# EAGLE design picduino (EAGLE 5.06)
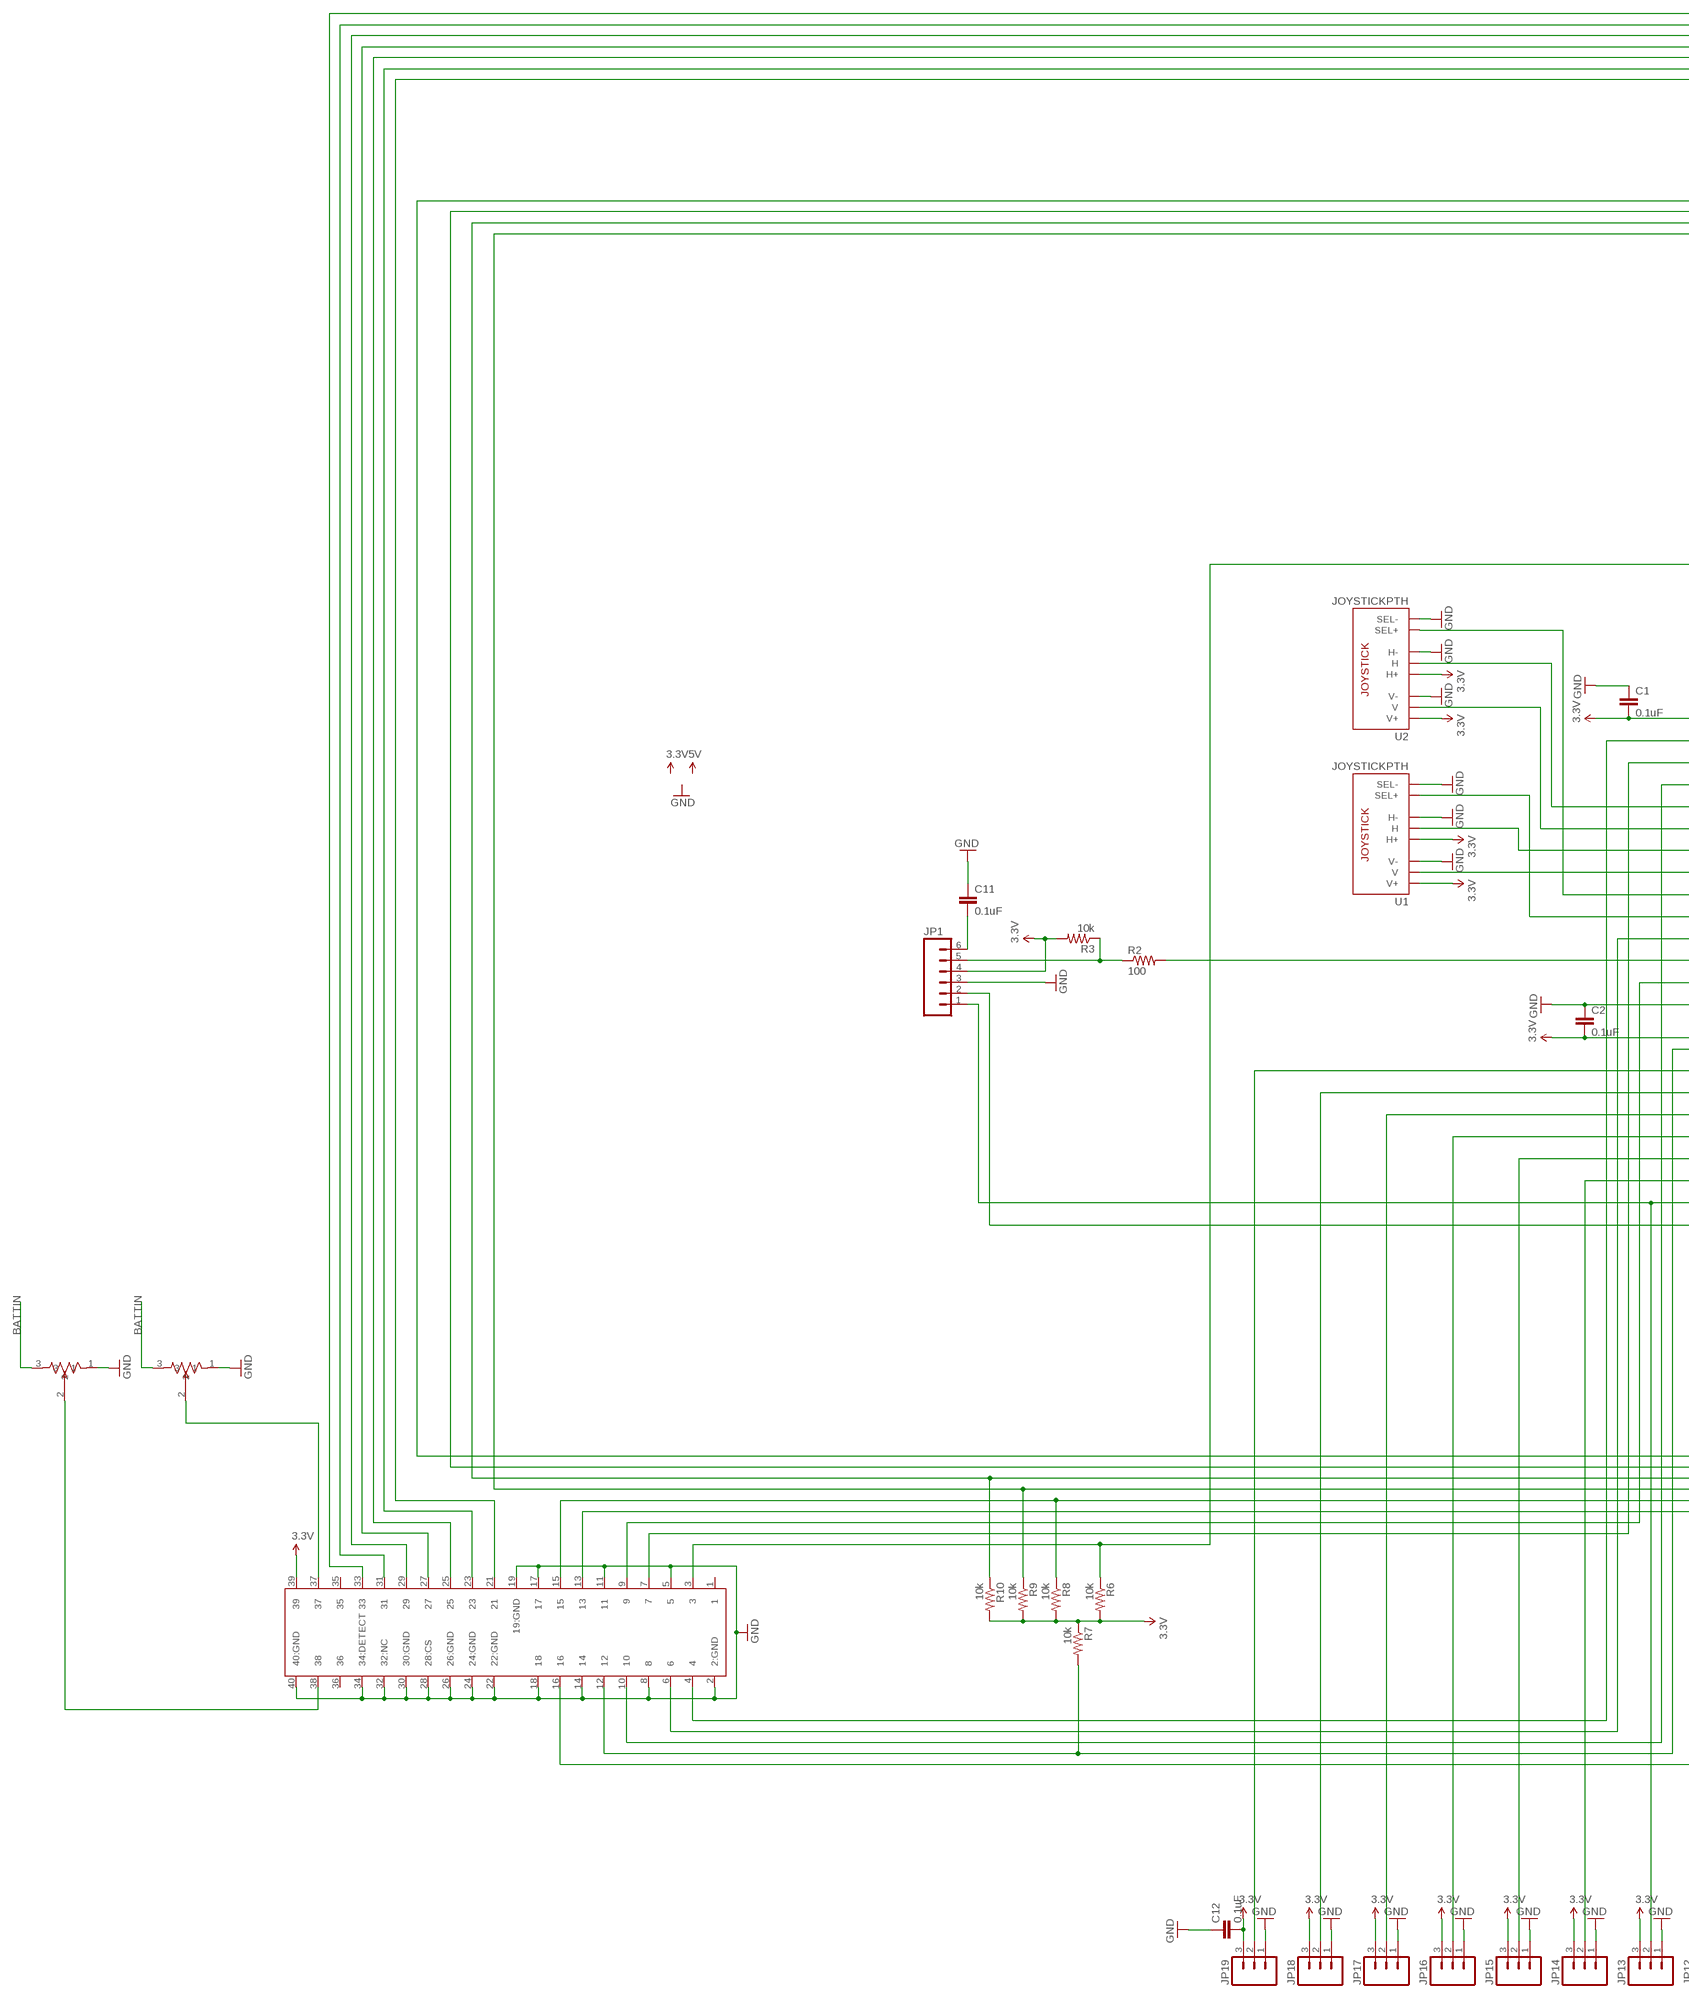
[diagram p0: schematic, sheet 1, part 1 of 2]
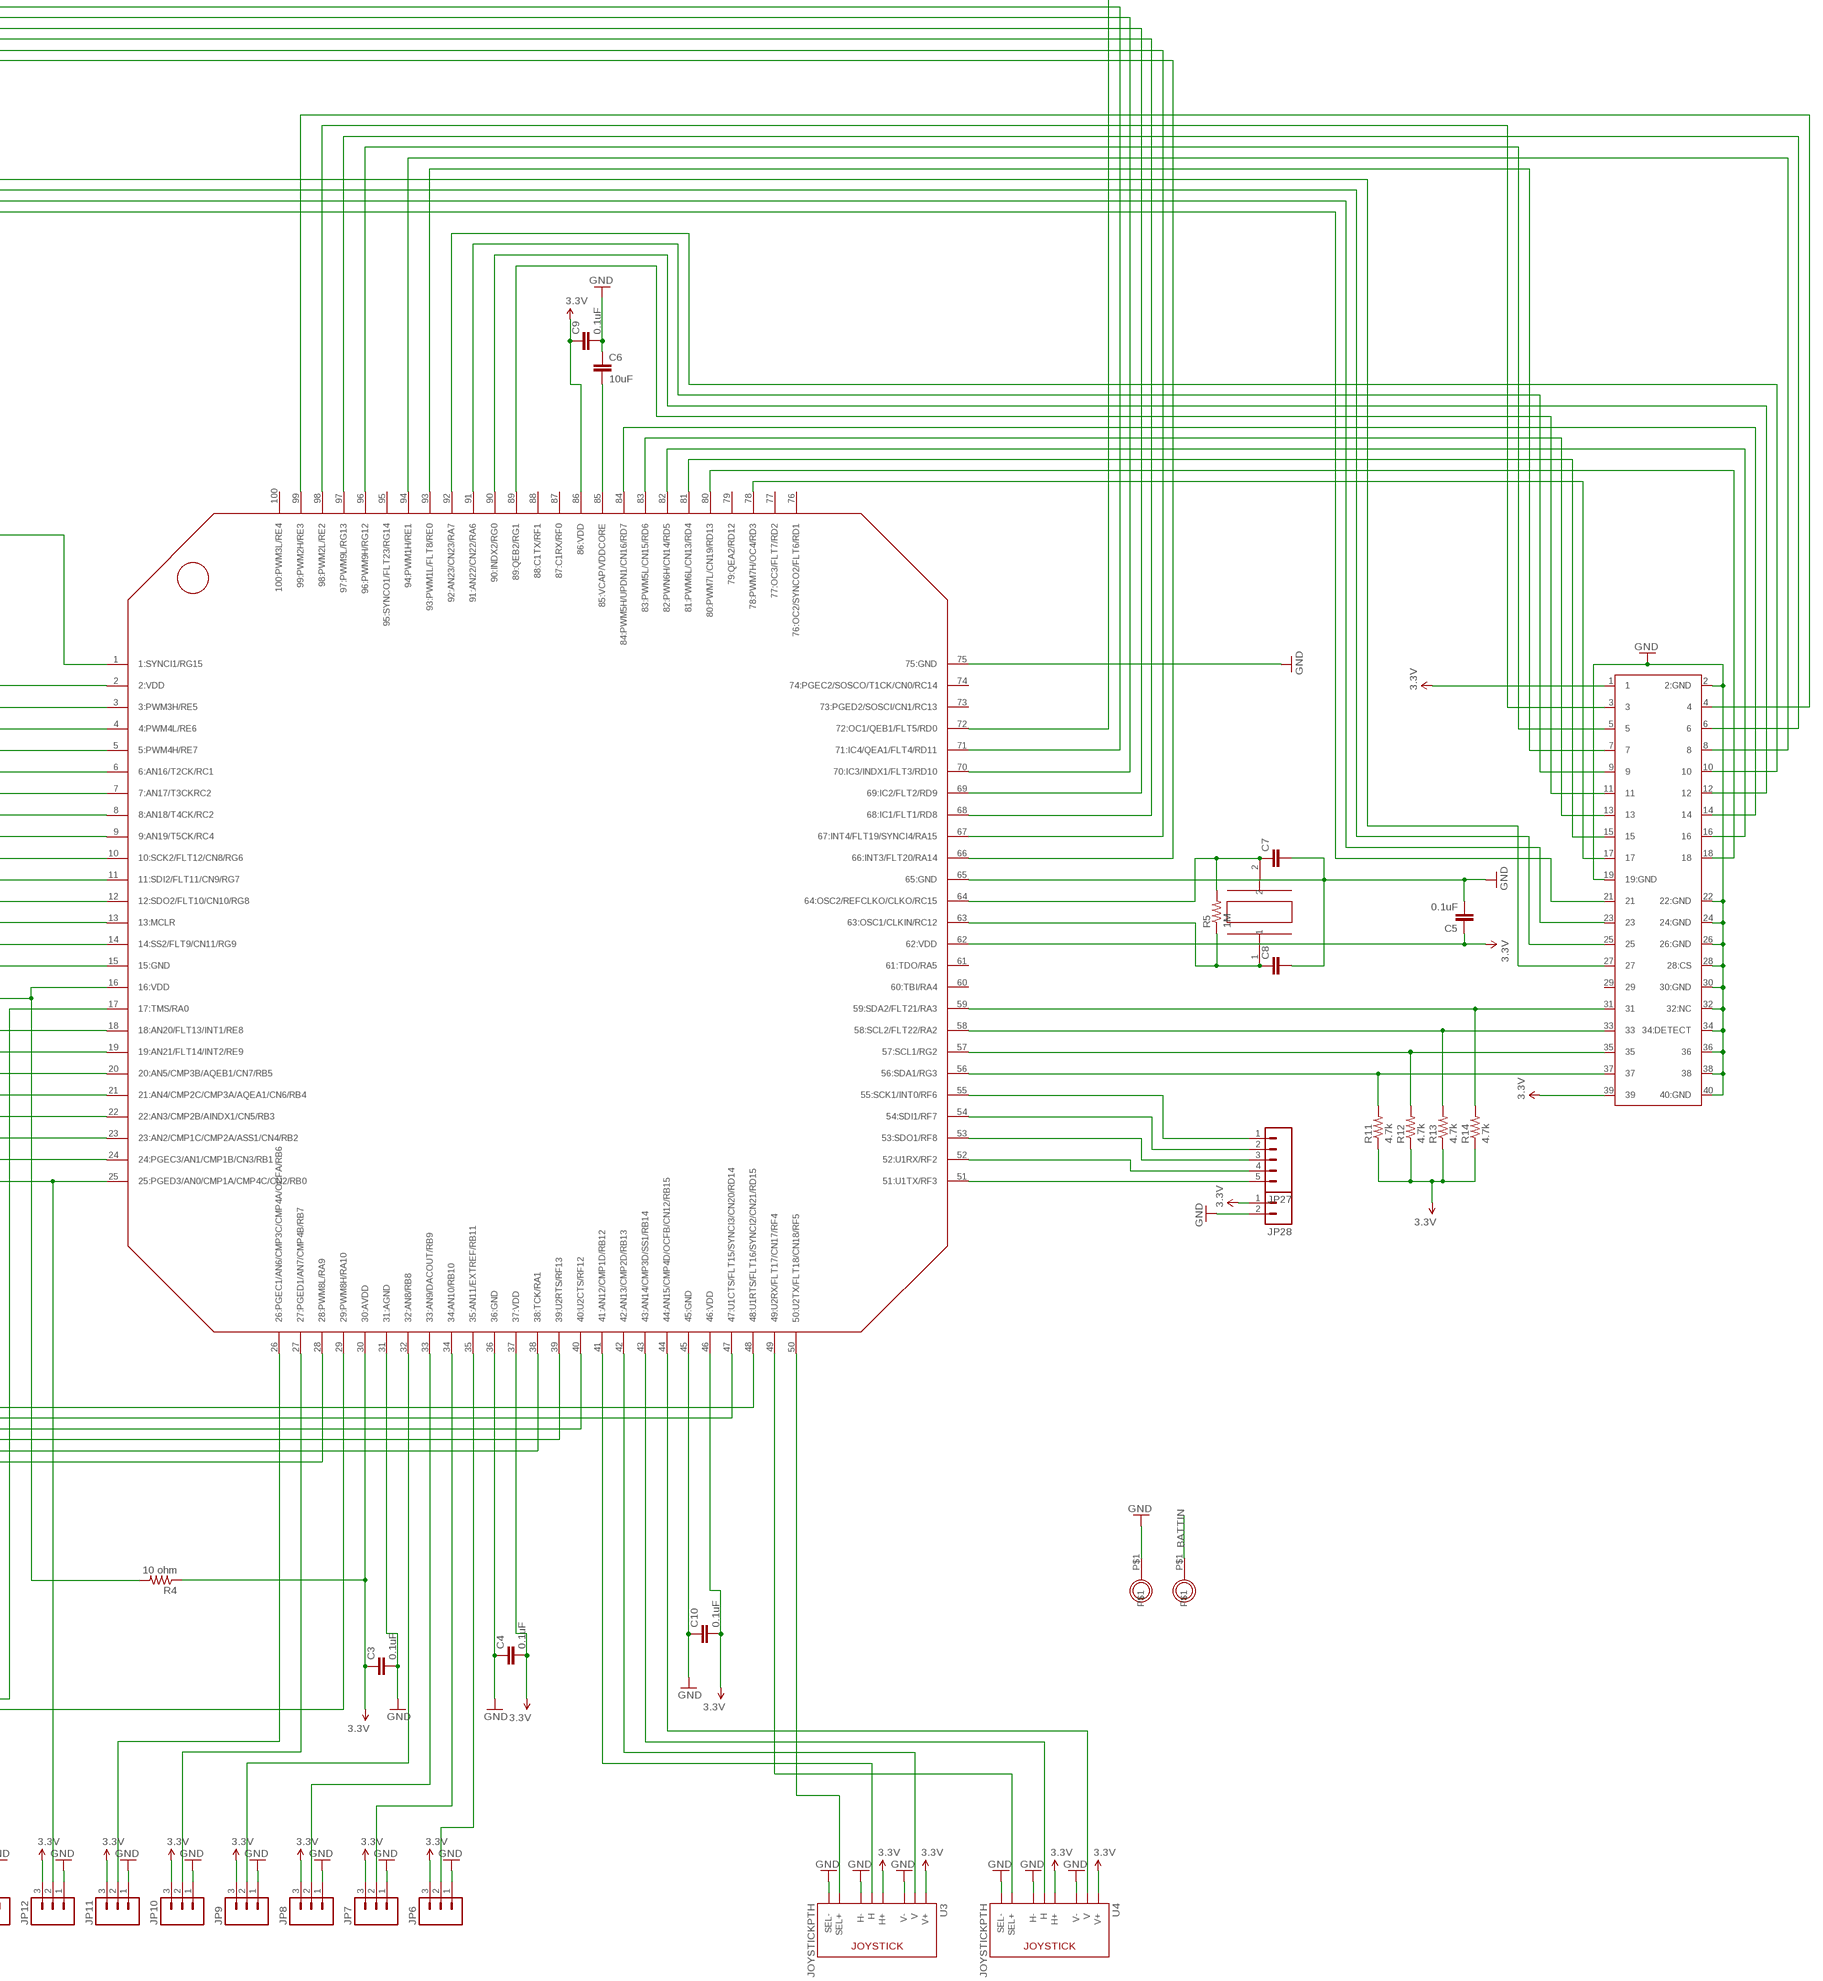
[diagram p1: schematic, sheet 1, part 2 of 2]

## Parts
C1  0.1uF  CAP0805  [0805]
C2  0.1uF  CAP0805  [0805]
C3  0.1uF  CAP0805  [0805]
C4  0.1uF  CAP0805  [0805]
C5  0.1uF  CAP0805  [0805]
C6  10uF  CAP0805  [0805]
C7  CAP0402-CAP  [0402-CAP]
C8  CAP0402-CAP  [0402-CAP]
C9  0.1uF  CAP0805  [0805]
C10  0.1uF  CAP0805  [0805]
C11  0.1uF  CAP0805  [0805]
C12  0.1uF  CAP0805  [0805]
JP1  M06LOCK  [1X06_LOCK]
JP6  M03LOCK  [1X03_LOCK]
JP7  M03LOCK  [1X03_LOCK]
JP8  M03LOCK  [1X03_LOCK]
JP9  M03LOCK  [1X03_LOCK]
JP10  M03LOCK  [1X03_LOCK]
JP11  M03LOCK  [1X03_LOCK]
JP12  M03LOCK  [1X03_LOCK]
JP13  M03LOCK  [1X03_LOCK]
JP14  M03LOCK  [1X03_LOCK]
JP15  M03LOCK  [1X03_LOCK]
JP16  M03LOCK  [1X03_LOCK]
JP17  M03LOCK  [1X03_LOCK]
JP18  M03LOCK  [1X03_LOCK]
JP19  M03LOCK  [1X03_LOCK]
JP27  M05LOCK  [1X05_LOCK]
JP28  M02LOCK  [1X02_LOCK]
R2  100  RESISTOR  [0805]
R3  10k  RESISTOR  [0805]
R4  10 ohm  RESISTOR  [0805]
R5  1M  RESISTOR  [0805]
R6  10k  RESISTOR  [0805]
R7  10k  RESISTOR  [0805]
R8  10k  RESISTOR  [0805]
R9  10k  RESISTOR  [0805]
R10  10k  RESISTOR  [0805]
R11  4.7k  RESISTOR  [0805]
R12  4.7k  RESISTOR  [0805]
R13  4.7k  RESISTOR  [0805]
R14  4.7k  RESISTOR  [0805]
U1  JOYSTICKPTH  [JOYSTICK]
U2  JOYSTICKPTH  [JOYSTICK]
U3  JOYSTICKPTH  [JOYSTICK]
U4  JOYSTICKPTH  [JOYSTICK]
U$1  PIC33FJGS610-12X12  [TQFP100-12X12]
U$3  HC49US  [HC49US]
U$4  IDEATTACH  [IDEATTACH]
U$8  THROUGH_HOLE_1MM  [THROUGH_HOLE_1MM]
U$9  THROUGH_HOLE_1MM  [THROUGH_HOLE_1MM]
U$10  TRIMPOT3319  [TRIMPOT3319]
U$11  TRIMPOT3319  [TRIMPOT3319]
U$12  IDEATTACH  [IDEATTACH]

## Nets
3.3V: C1.2 C2.2 C3.1 C4.2 C5.1 C9.1 C10.2 C12.2 JP1.4 JP6.3 JP7.3 JP8.3 JP9.3 JP10.3 JP11.3 JP12.3 JP13.3 JP14.3 JP15.3 JP16.3 JP17.3 JP18.3 JP19.3 JP28.1 R3.2 R4.1 R4.2 R6.2 R7.1 R8.2 R9.2 R10.2 R11.1 R12.1 R13.1 R14.1 U1.H1(H+) U1.V1(V+) U2.H1(H+) U2.V1(V+) U3.H1(H+) U3.V1(V+) U4.H1(H+) U4.V1(V+) U$1.2(2:VDD) U$1.16(16:VDD) U$1.30(30:AVDD) U$1.37(37:VDD) U$1.46(46:VDD) U$1.62(62:VDD) U$1.86(86:VDD) U$4.39 U$12.1 U$12.39
BATTIN: U$9.P$1 U$10.3 U$11.3
GND: C1.1 C2.1 C3.2 C4.1 C5.2 C6.1 C7.2 C8.2 C9.2 C10.1 C11.1 C12.1 JP1.3 JP6.1 JP7.1 JP8.1 JP9.1 JP10.1 JP11.1 JP12.1 JP13.1 JP14.1 JP15.1 JP16.1 JP17.1 JP18.1 JP19.1 JP28.2 U1.B2A(SEL-) U1.H3(H-) U1.V3(V-) U2.B2A(SEL-) U2.H3(H-) U2.V3(V-) U3.B2A(SEL-) U3.H3(H-) U3.V3(V-) U4.B2A(SEL-) U4.H3(H-) U4.V3(V-) U$1.15(15:GND) U$1.31(31:AGND) U$1.36(36:GND) U$1.45(45:GND) U$1.65(65:GND) U$1.75(75:GND) U$4.2(2:GND) U$4.5 U$4.8 U$4.11 U$4.14 U$4.17 U$4.18 U$4.19(19:GND) U$4.22(22:GND) U$4.24(24:GND) U$4.26(26:GND) U$4.28(28:CS) U$4.30(30:GND) U$4.32(32:NC) U$4.34(34:DETECT) U$4.40(40:GND) U$8.P$1 U$10.1 U$11.1 U$12.2(2:GND) U$12.19(19:GND) U$12.22(22:GND) U$12.24(24:GND) U$12.26(26:GND) U$12.28(28:CS) U$12.30(30:GND) U$12.32(32:NC) U$12.34(34:DETECT) U$12.36 U$12.38 U$12.40(40:GND)
INT: JP27.4 U$1.52(52:U1RX/RF2)
J1S: U4.B1A(SEL+) U$1.49(49:U2RX/FLT17/CN17/RF4)
J1X: U4.H2(H) U$1.43(43:AN14/CMP3D/SS1/RB14)
J1Y: U4.V2(V) U$1.44(44:AN15/CMP4D/OCFB/CN12/RB15)
J2S: U3.B1A(SEL+) U$1.50(50:U2TX/FLT18/CN18/RF5)
J2X: U3.H2(H) U$1.41(41:AN12/CMP1D/RB12)
J2Y: U3.V2(V) U$1.42(42:AN13/CMP2D/RB13)
J3S: U1.B1A(SEL+) U$1.11(11:SDI2/FLT11/CN9/RG7)
J3X: U1.H2(H) U$1.8(8:AN18/T4CK/RC2)
J3Y: U1.V2(V) U$1.9(9:AN19/T5CK/RC4)
J4S: U2.B1A(SEL+) U$1.10(10:SCK2/FLT12/CN8/RG6)
J4X: U2.H2(H) U$1.6(6:AN16/T2CK/RC1)
J4Y: U2.V2(V) U$1.7(7:AN17/T3CKRC2)
LCDD1: U$1.69(69:IC2/FLT2/RD9) U$4.27
LCDD2: U$1.68(68:IC1/FLT1/RD8) U$4.25
LCDD3: U$1.67(67:INT4/FLT19/SYNCI4/RA15) U$4.23
LCDD4: U$1.66(66:INT3/FLT20/RA14) U$4.21
LCDE: U$1.70(70:IC3/INDX1/FLT3/RD10) U$4.29
LCDR/W: U$1.71(71:IC4/QEA1/FLT4/RD11) U$4.31
LCDRS: U$1.72(72:OC1/QEB1/FLT5/RD0) U$4.33
MCLR: R2.2 U$1.13(13:MCLR)
N$1: U$1.78(78:PWM7H/OC4/RD3) U$12.17
N$2: U$4.37 U$11.2
N$3: U$4.38 U$10.2
N$4: JP1.5 R2.1 R3.1
N$5: U$1.80(80:PWM7L/CN19/RD13) U$12.18
N$6: U$1.81(81:PWM6L/CN13/RD4) U$12.15
N$7: R7.2 U$1.17(17:TMS/RA0) U$4.12
N$9: U$1.82(82:PWN6H/CN14/RD5) U$12.16
N$10: U$1.29(29:PWM8H/RA10) U$4.16
N$11: U$1.83(83:PWM5L/CN15/RD6) U$12.13
N$12: U$1.84(84:PWM5H/UPDN1/CN16/RD7) U$12.14
N$13: U$1.28(28:PWM8L/RA9) U$4.13
N$14: R8.1 U$1.38(38:TCK/RA1) U$4.15
N$15: U$1.89(89:QEB2/RG1) U$12.11
N$16: U$1.90(90:INDX2/RG0) U$12.12
N$17: U$1.91(91:AN22/CN22/RA6) U$12.9
N$18: U$1.92(92:AN23/CN23/RA7) U$12.10
N$19: U$1.93(93:PWM1L/FLT8/RE0) U$12.7
N$20: U$1.94(94:PWM1H/RE1) U$12.8
N$21: U$1.96(96:PWM9H/RG12) U$12.5
N$23: U$1.97(97:PWM9L/RG13) U$12.6
N$24: U$1.98(98:PWM2L/RE2) U$12.3
N$25: U$1.99(99:PWM2H/RE3) U$12.4
N$39: R6.1 U$1.1(1:SYNCI1/RG15) U$4.3
N$40: U$1.3(3:PWM3H/RE5) U$4.4
N$41: U$1.12(12:SDO2/FLT10/CN10/RG8) U$4.6
N$42: U$1.4(4:PWM4L/RE6) U$4.7
N$43: U$1.14(14:SS2/FLT9/CN11/RG9) U$4.9
N$44: U$1.5(5:PWM4H/RE7) U$4.10
N$50: R9.1 U$1.39(39:U2RTS/RF13) U$12.21
N$51: R10.1 U$1.40(40:U2CTS/RF12) U$12.23
N$52: U$1.47(47:U1CTS/FLT15/SYNCI3/CN20/RD14) U$12.25
N$58: U$1.48(48:U1RTS/FLT16/SYNCI2/CN21/RD15) U$12.27
N$59: R11.2 U$1.56(56:SDA1/RG3) U$12.37
N$60: R12.2 U$1.57(57:SCL1/RG2) U$12.35
N$61: R13.2 U$1.58(58:SCL2/FLT22/RA2) U$12.33
N$62: R14.2 U$1.59(59:SDA2/FLT21/RA3) U$12.31
OSC1: C8.1 R5.1 U$1.63(63:OSC1/CLKIN/RC12) U$3.1
OSC2: C7.1 R5.2 U$1.64(64:OSC2/REFCLKO/CLKO/RC15) U$3.2
P1: JP6.2 U$1.35(35:AN11/EXTREF/RB11)
P2: JP7.2 U$1.34(34:AN10/RB10)
P3: JP8.2 U$1.33(33:AN9/DACOUT/RB9)
P4: JP9.2 U$1.32(32:AN8/RB8)
P5: JP10.2 U$1.27(27:PGED1/AN7/CMP4B/RB7)
P6: JP11.2 U$1.26(26:PGEC1/AN6/CMP3C/CMP4A/OCFA/RB6)
P7: JP1.2 JP12.2 U$1.25(25:PGED3/AN0/CMP1A/CMP4C/CN2/RB0)
P8: JP1.1 JP13.2 U$1.24(24:PGEC3/AN1/CMP1B/CN3/RB1)
P9: JP14.2 U$1.23(23:AN2/CMP1C/CMP2A/ASS1/CN4/RB2)
P10: JP15.2 U$1.22(22:AN3/CMP2B/AINDX1/CN5/RB3)
P11: JP16.2 U$1.21(21:AN4/CMP2C/CMP3A/AQEA1/CN6/RB4)
P12: JP17.2 U$1.20(20:AN5/CMP3B/AQEB1/CN7/RB5)
P13: JP18.2 U$1.19(19:AN21/FLT14/INT2/RE9)
P14: JP19.2 U$1.18(18:AN20/FLT13/INT1/RE8)
PROGCAP: C11.2 JP1.6
RESET: JP27.5 U$1.51(51:U1TX/RF3)
SCK: JP27.1 U$1.55(55:SCK1/INT0/RF6)
SDI: JP27.2 U$1.54(54:SDI1/RF7)
SDO: JP27.3 U$1.53(53:SDO1/RF8)
VDDCORE: C6.2 U$1.85(85:VCAP/VDDCORE)
Unconnected: U$1.60(60:TBI/RA4) U$1.61(61:TDO/RA5) U$1.73(73:PGED2/SOSCI/CN1/RC13) U$1.74(74:PGEC2/SOSCO/T1CK/CN0/RC14) U$1.76(76:OC2/SYNCO2/FLT6/RD1) U$1.77(77:OC3/FLT7/RD2) U$1.79(79:QEA2/RD12) U$1.87(87:C1RX/RF0) U$1.88(88:C1TX/RF1) U$1.95(95:SYNCO1/FLT23/RG14) U$1.100(100:PWM3L/RE4) U$4.1 U$4.35 U$4.36 U$12.29

## Library data of the parts
C1-C12 = SparkFun:CAP: Capacitor Standard 0603 ceramic capacitor, and 0.1" leaded capacitor.
JP1 = SparkFun:M06: Header 6 Standard 6-pin 0.1" header. Use with straight break away headers (SKU : PRT-00116), right angle break away headers (PRT-00553), swiss pins (PRT-00743), machine pins (PRT-00117), and female headers (PRT-00115). Molex polarized connector foot print use with SKU : PRT-08094 with associated crimp pins and housings. NOTES ON THE VARIANTS LOCK and LOCK_LONGPADS... This footprint was designed to help hold the alignment of a through-hole component (i.e. 6-pin header) while soldering it into place. You may notice that each hole has been shifted either up or down by 0.005 of an inch from it's more standard position (which is a perfectly straight line). This slight alteration caused the pins (the squares in the middle) to touch the edges of the holes. Because they are alternating, it causes a "brace" to hold the component in place. 0.005 has proven to be the perfect amount of "off-center" position when using our standard breakaway headers. Although looks a little odd when you look at the bare footprint, once you have a header in there, the alteration is very hard to notice. Also, if you push a header all the way into place, it is covered up entirely on the bottom side. This idea of altering the position of holes to aid alignment will be further integrated into the Sparkfun Library for other footprints. It can help hold any component with 3 or more connection pins.
JP6-JP19 = SparkFun:M03: Header 3 Standard 3-pin 0.1" header. Use with straight break away headers (SKU : PRT-00116), right angle break away headers (PRT-00553), swiss pins (PRT-00743), machine pins (PRT-00117), and female headers (PRT-00115). Molex polarized connector foot print use with SKU : PRT-08232 with associated crimp pins and housings.
JP27 = SparkFun:M05: Header 5 Standard 5-pin 0.1" header. Use with straight break away headers (SKU : PRT-00116), right angle break away headers (PRT-00553), swiss pins (PRT-00743), machine pins (PRT-00117), and female headers (PRT-00115). Molex polarized connector foot print use with SKU : PRT-08230 with associated crimp pins and housings.
JP28 = SparkFun:M02: Header 2 Standard 2-pin 0.1" header. Use with straight break away headers (SKU : PRT-00116), right angle break away headers (PRT-00553), swiss pins (PRT-00743), machine pins (PRT-00117), and female headers (PRT-00115). Molex polarized connector foot print use with SKU : PRT-08233 with associated crimp pins and housings.
R2-R14 = SparkFun:RESISTOR: Resistor Basic schematic elements and footprints for 0603, 1206, and PTH 1/10th watt (small) resistors.
U1-U4 = SparkFun:JOYSTICK: Thumb Joystick Joystick commonly found in PS2 controllers. Two pots and a select switch. Footprint proven. Spark Fun Electronics SKU : COM-09032
U$1 = 1dah:PIC33FJGS610-12X12
U$3 = 1dah:HC49US: 16 MHz crystal
U$4 U$12 = 1dah:IDEATTACH
U$8 U$9 = 1dah:THROUGH_HOLE_1MM
U$10 U$11 = 1dah:TRIMPOT3319: Bournes Trimpot

## Board
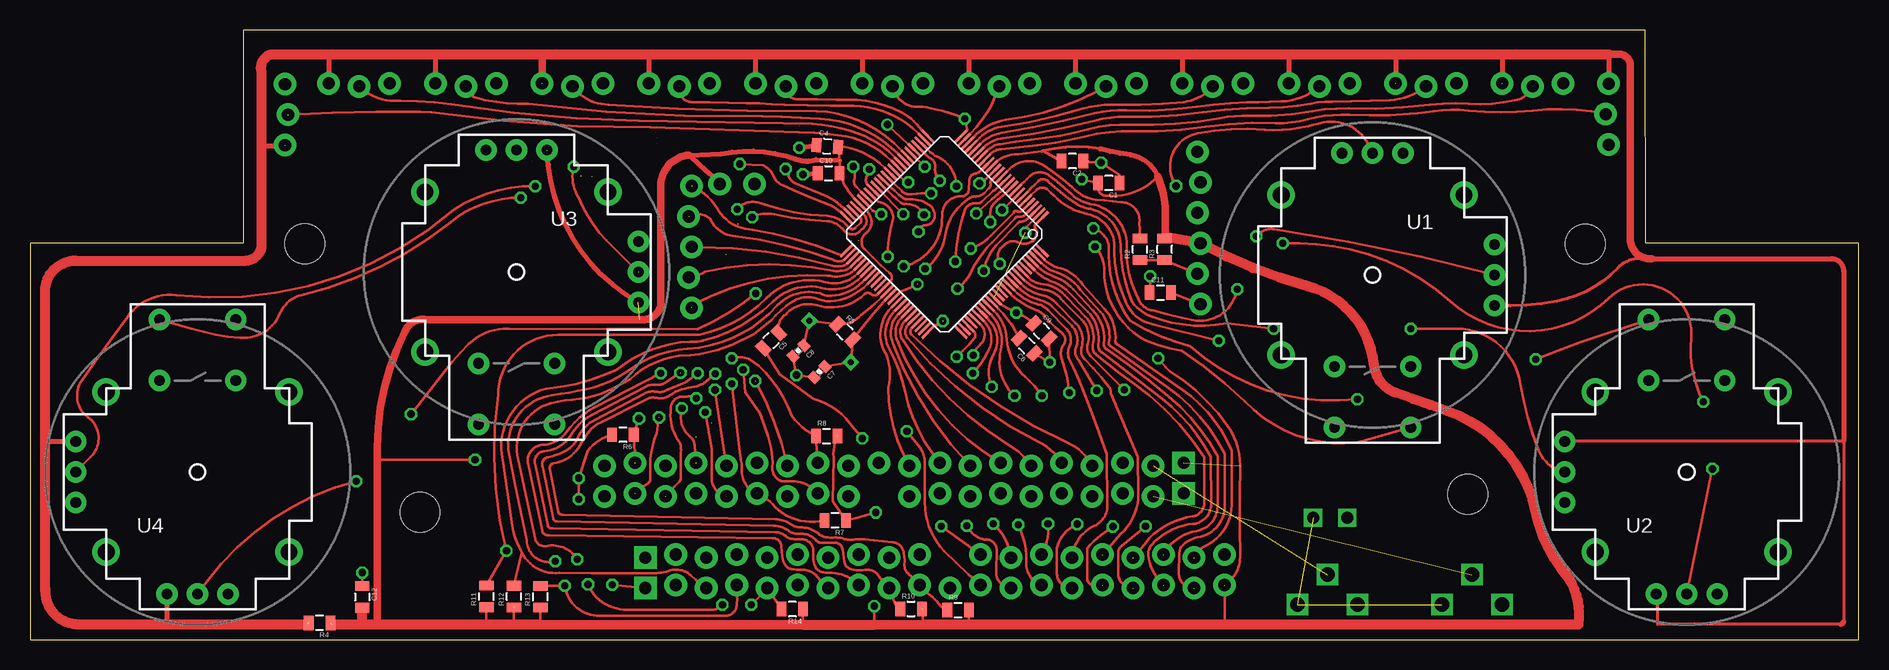
[diagram p2: board, top side]
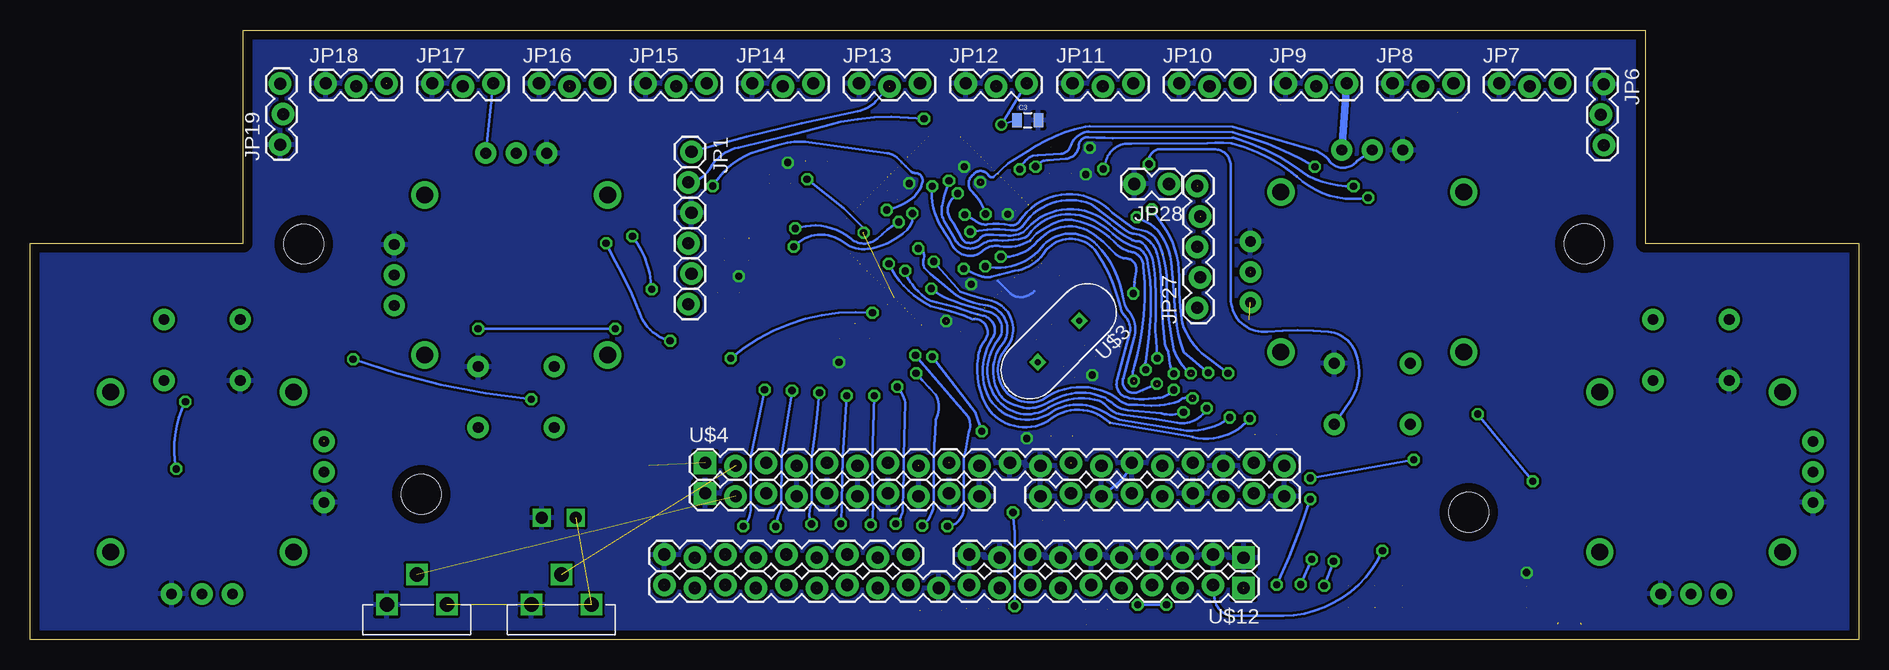
[diagram p3: board, bottom side, seen from below]

Size 152.4 x 50.8 mm. Coordinates in mm from the lower left corner, seen from the top.
Outline: 0,0 152.38,0 152.4,33.02 134.62,33.02 134.62,50.8 17.78,50.8 17.78,33.02 0,33.02 0,0
Copper layers (1*16): Top 0.035mm / dielectric 1.5mm / Bottom 0.035mm
Design rules "goldenpcb *": minimum track width 8mil, minimum drill 18mil, track to track 8mil, track to pad 8mil, pad to pad 8mil, via to via 8mil, smd to smd 8mil, copper to edge 30mil, drill to drill 9mil, minimum pad ring 10mil, minimum via ring 8mil, stop-mask expansion 4mil, vias tented up to drill 0mil, thermal gap 10mil

### Footprints (pad centres in the part's own frame; a part is rotated, then mirrored left to right if it is on the bottom)
0805 = smd 0.8 x 1.2: 1 -0.9,0; 2 0.9,0
0402-CAP = smd 0.7 x 0.9: 1 -0.65,0; 2 0.65,0
TQFP100-14X14 = smd 1.5 x 0.25: 1 -7.75,6; 2 -7.75,5.5; 3 -7.75,5; 4 -7.75,4.5; 5 -7.75,4; 6 -7.75,3.5; 7 -7.75,3; 8 -7.75,2.5; 9 -7.75,2; 10 -7.75,1.5; 11 -7.75,1; 12 -7.75,0.5; 13 -7.75,0; 14 -7.75,-0.5; 15 -7.75,-1; 16 -7.75,-1.5; 17 -7.75,-2; 18 -7.75,-2.5; 19 -7.75,-3; 20 -7.75,-3.5; 21 -7.75,-4; 22 -7.75,-4.5; 23 -7.75,-5; 24 -7.75,-5.5; 25 -7.75,-6; 51 7.75,-6; 52 7.75,-5.5; 53 7.75,-5; 54 7.75,-4.5; 55 7.75,-4; 56 7.75,-3.5; 57 7.75,-3; 58 7.75,-2.5; 59 7.75,-2; 60 7.75,-1.5; 61 7.75,-1; 62 7.75,-0.5; 63 7.75,0; 64 7.75,0.5; 65 7.75,1; 66 7.75,1.5; 67 7.75,2; 68 7.75,2.5; 69 7.75,3; 70 7.75,3.5; 71 7.75,4; 72 7.75,4.5; 73 7.75,5; 74 7.75,5.5; 75 7.75,6 | smd 0.25 x 1.5: 26 -6,-7.75; 27 -5.5,-7.75; 28 -5,-7.75; 29 -4.5,-7.75; 30 -4,-7.75; 31 -3.5,-7.75; 32 -3,-7.75; 33 -2.5,-7.75; 34 -2,-7.75; 35 -1.5,-7.75; 36 -1,-7.75; 37 -0.5,-7.75; 38 0,-7.75; 39 0.5,-7.75; 40 1,-7.75; 41 1.5,-7.75; 42 2,-7.75; 43 2.5,-7.75; 44 3,-7.75; 45 3.5,-7.75; 46 4,-7.75; 47 4.5,-7.75; 48 5,-7.75; 49 5.5,-7.75; 50 6,-7.75; 76 6,7.75; 77 5.5,7.75; 78 5,7.75; 79 4.5,7.75; 80 4,7.75; 81 3.5,7.75; 82 3,7.75; 83 2.5,7.75; 84 2,7.75; 85 1.5,7.75; 86 1,7.75; 87 0.5,7.75; 88 0,7.75; 89 -0.5,7.75; 90 -1,7.75; 91 -1.5,7.75; 92 -2,7.75; 93 -2.5,7.75; 94 -3,7.75; 95 -3.5,7.75; 96 -4,7.75; 97 -4.5,7.75; 98 -5,7.75; 99 -5.5,7.75; 100 -6,7.75
1X06_LOCK = drill 1.016 pad 1.88 round: 1 0,0; 2 2.54,-0.254; 3 5.08,0; 4 7.62,-0.254; 5 10.16,0; 6 12.7,-0.254
1X03_LOCK = drill 1.016 pad 1.88 round: 1 0,0.127; 2 2.54,-0.127; 3 5.08,0.127
1X05_LOCK = drill 1.016 pad 1.88 round: 1 0,0.127; 2 2.54,-0.127; 3 5.08,0.127; 4 7.62,-0.127; 5 10.16,0.127
1X02_LOCK = drill 1.016 pad 1.88 round: 1 -0.178,0; 2 2.718,0
JOYSTICK = drill 0.9 pad 1.778 round: B1A -3.175,12.7; B1B 3.175,12.7; B2A -3.175,7.62; B2B 3.175,7.62 | drill 0.889 pad 1.778 round: H1 -2.54,-10.16; H2 0,-10.16; H3 2.54,-10.16; V1 -10.16,2.54; V2 -10.16,0; V3 -10.16,-2.54 | drill 1.397 pad 2.286 round: MOUNT1 -7.62,6.668; MOUNT2 -7.62,-6.668; MOUNT3 7.62,-6.668; MOUNT4 7.62,6.668
TQFP100-12X12 = smd 1.5 x 0.2: 1 -6.7,4.8; 2 -6.7,4.4; 3 -6.7,4; 4 -6.7,3.6; 5 -6.7,3.2; 6 -6.7,2.8; 7 -6.7,2.4; 8 -6.7,2; 9 -6.7,1.6; 10 -6.7,1.2; 11 -6.7,0.8; 12 -6.7,0.4; 13 -6.7,0; 14 -6.7,-0.4; 15 -6.7,-0.8; 16 -6.7,-1.2; 17 -6.7,-1.6; 18 -6.7,-2; 19 -6.7,-2.4; 20 -6.7,-2.8; 21 -6.7,-3.2; 22 -6.7,-3.6; 23 -6.7,-4; 24 -6.7,-4.4; 25 -6.7,-4.8; 51 6.7,-4.8; 52 6.7,-4.4; 53 6.7,-4; 54 6.7,-3.6; 55 6.7,-3.2; 56 6.7,-2.8; 57 6.7,-2.4; 58 6.7,-2; 59 6.7,-1.6; 60 6.7,-1.2; 61 6.7,-0.8; 62 6.7,-0.4; 63 6.7,0; 64 6.7,0.4; 65 6.7,0.8; 66 6.7,1.2; 67 6.7,1.6; 68 6.7,2; 69 6.7,2.4; 70 6.7,2.8; 71 6.7,3.2; 72 6.7,3.6; 73 6.7,4; 74 6.7,4.4; 75 6.7,4.8 | smd 0.2 x 1.5: 26 -4.8,-6.7; 27 -4.4,-6.7; 28 -4,-6.7; 29 -3.6,-6.7; 30 -3.2,-6.7; 31 -2.8,-6.7; 32 -2.4,-6.7; 33 -2,-6.7; 34 -1.6,-6.7; 35 -1.2,-6.7; 36 -0.8,-6.7; 37 -0.4,-6.7; 38 0,-6.7; 39 0.4,-6.7; 40 0.8,-6.7; 41 1.2,-6.7; 42 1.6,-6.7; 43 2,-6.7; 44 2.4,-6.7; 45 2.8,-6.7; 46 3.2,-6.7; 47 3.6,-6.7; 48 4,-6.7; 49 4.4,-6.7; 50 4.8,-6.7; 76 4.8,6.7; 77 4.4,6.7; 78 4,6.7; 79 3.6,6.7; 80 3.2,6.7; 81 2.8,6.7; 82 2.4,6.7; 83 2,6.7; 84 1.6,6.7; 85 1.2,6.7; 86 0.8,6.7; 87 0.4,6.7; 88 0,6.7; 89 -0.4,6.7; 90 -0.8,6.7; 91 -1.2,6.7; 92 -1.6,6.7; 93 -2,6.7; 94 -2.4,6.7; 95 -2.8,6.7; 96 -3.2,6.7; 97 -3.6,6.7; 98 -4,6.7; 99 -4.4,6.7; 100 -4.8,6.7
HC49US = drill 0.5 square: 1 -2.44,0; 2 2.44,0
IDEATTACH = drill 1.016 pad 1.88 round: 1 48.26,-0.127; 2 48.26,-2.667; 3 45.72,0.127; 4 45.72,-2.413; 5 43.18,-0.127; 6 43.18,-2.667; 7 40.64,0.127; 8 40.64,-2.413; 9 38.1,-0.127; 10 38.1,-2.667; 11 35.56,0.127; 12 35.56,-2.413; 13 33.02,-0.127; 14 33.02,-2.667; 15 30.48,0.127; 16 30.48,-2.413; 17 27.94,-0.127; 18 27.94,-2.667; 19 25.4,0.127; 21 22.86,-0.127; 22 22.86,-2.667; 23 20.32,0.127; 24 20.32,-2.413; 25 17.78,-0.127; 26 17.78,-2.667; 27 15.24,0.127; 28 15.24,-2.413; 29 12.7,-0.127; 30 12.7,-2.667; 31 10.16,0.127; 32 10.16,-2.413; 33 7.62,-0.127; 34 7.62,-2.667; 35 5.08,0.127; 36 5.08,-2.413; 37 2.54,-0.127; 38 2.54,-2.667 | drill 1.016 pad 1.88 square: 39 0,0.127; 40 0,-2.413
STAND-OFF = hole 3.302: 0,0
THROUGH_HOLE_1MM = drill 1 square: P$1 0,0
TRIMPOT3319 = drill 1.2 square: 1 -2.5,0; 2 0,2.5; 3 2.5,0

### Placement (x,y rotation side)
C1  89.89,38.05 180 top
C2  86.87,39.88 180 top
C3  69.26,43.28 0 bottom
C4  66.43,41.12 355 top
C5  61.76,24.93 225 top
C6  83.06,24.49 135 top
C7  65.79,22.31 225 top
C8  64.03,24.07 225 top
C9  84.29,25.71 315 top
C10  66.55,38.86 0 top
C11  94.2,28.92 0 top
C12  27.69,3.56 270 top
E$1  [TQFP100-14X14]  121.92,-22.86 0 top  (outside the outline)
JP1  97.28,40.65 270 bottom
JP6  21.37,46.28 270 bottom
JP7  29.97,46.23 0 bottom
JP8  38.86,46.23 0 bottom
JP9  47.75,46.23 0 bottom
JP10  56.64,46.23 0 bottom
JP11  65.53,46.23 0 bottom
JP12  74.42,46.23 0 bottom
JP13  83.31,46.23 0 bottom
JP14  92.2,46.23 0 bottom
JP15  101.09,46.23 0 bottom
JP16  109.98,46.23 0 bottom
JP17  118.87,46.23 0 bottom
JP18  127.76,46.23 0 bottom
JP19  131.43,41.25 90 bottom
JP27  55.01,27.65 90 bottom
JP28  57.66,37.97 180 bottom
R2  92.5,32.52 90 top
R3  94.55,32.53 90 top
R4  24.13,1.4 180 top
R5  67.91,25.64 315 top
R6  49.42,17.07 180 top
R7  67.09,9.93 180 top
R8  66.39,16.96 0 top
R9  77.33,2.46 0 top
R10  73.42,2.56 0 top
R11  38.03,3.6 90 top
R12  40.33,3.59 90 top
R13  42.53,3.58 90 top
R14  63.53,2.53 180 top
U1  111.88,30.38 180 top
U2  138.06,13.97 0 top
U3  40.54,30.64 180 top
U4  13.97,13.97 0 top
U$1  76.2,33.78 225 top
U$3  66.68,24.86 225 bottom
U$4  96.14,14.61 0 bottom
U$5  [STAND-OFF]  32.5,10.6 0 top
U$8  109.76,10.15 0 top
U$9  106.92,10.15 0 top
U$10  120.16,2.92 0 bottom
U$11  108.11,2.92 0 bottom
U$12  51.27,4.42 180 bottom
U$13  [STAND-OFF]  22.89,32.98 0 top
U$14  [STAND-OFF]  119.8,12.1 0 top
U$15  [STAND-OFF]  129.6,32.97 0 top

### Tracks (layer width: path | path; a pad name or v marks a point on that pad's centre or on a via)
3.3V  (via drill 0.6)  (54 unrouted)
  Top 0.2: v71.45,42.92 73.2,41.3 73.21,41.3 U$1.30 | 80.92,27.93 U$1.86 | 84.3,40.69 arc-3 82.37,40.46 arc29 80.67,39.95 U$1.16 | 89,38.05 89,37.74 arc90 89.66,36.98 90.61,36.98 arc43 93.98,38.61 | v87.65,38.35 C1.2 | U$1.46 69.8,35.65 arc-48 70.12,34.59 70.03,34.33 arc-34 69.65,33.86 arc96 69.56,32.51 arc4 71.61,30.58 arc-92 71.69,29.83 U$1.62 arc1 70.64,28.79 arc-89 70.11,28.78 arc87 69.53,28.78 arc-60 65.6,27.85 arc66 62.97,27.08 arc73 C5.1 | 64.4,1.25 64.4,2.45 R14.1 | 38,1.27 38,2.7 R11.1 | 40.33,1.27 40.31,2.69 R12.1 | 42.54,1.27 R13.1 | 70.36,1.25 v70.36,2.79 | v70.48,10.59 arc-5 R7.1 | R7.1 66.88,11.51 66.96,15.17 arc-30 R8.2 | v82.94,33.91 82.93,33.93 arc-72 83,34.35 | 28.96,14.99 v37.08,14.99 | R6.2 arc39 46.48,15.75 v45.72,13.46 45.72,11.94 arc23 v45.72,11.68 | v48.51,4.57 51.28,4.29 | 74.4,1.27 74.4,2.56 | 78.23,1.27 78.23,2.44 | 99.57,1.27 99.57,4.32 arc13 99.54,4.55 100,4.95 arc49 100.84,6.86 arc-2 100.84,14.48 arc36 99.82,17.78 arc23 95,22.35 arc-7 v94,23.44 | 80.92,27.91 v82.19,27.23 arc-21 C9.1
  Top 0.203: 83,34.35 U$1.2 | 71.75,38.79 71.22,39.32 arc40 67.31,41.15 C4.2 67.46,39.92 67.46,38.86 67.72,38.25 arc22 68.71,36.75 69.19,36.27
  Top 0.254: 150.88,1.27 135.64,1.27 135.64,3.81 | 151.13,1.52 151.13,16.51 127.91,16.51 | 135.13,31.75 134.11,31.75 arc46 132.33,30.99 arc-35 127.25,28.19 arc-15 U1.V1 | 89.15,40.89 arc24 84.43,40.72 | 84.43,40.72 arc-4 84.3,40.69 | 84.43,40.72 C2.2
  Top 0.406: 131.57,48.77 JP19.3 | 24.89,48.77 JP7.3 | 33.78,48.77 JP8.3 | 51.56,48.77 JP10.3 | 60.45,48.77 JP11.3 | 69.34,48.77 JP12.3 | 78.23,48.77 JP13.3 | 87.12,48.77 JP14.3 | 96.01,48.77 JP15.3 | 104.9,48.77 JP16.3 | 113.79,48.77 JP17.3 | 122.68,48.77 122.68,46.33 | 19.3,41.15 21.08,41.15 JP6.3 | 135.64,3.81 135.51,3.81 | 11.43,1.27 U4.H1 | 1.27,16.51 U4.V1 | 151.13,1.52 arc-90 150.88,1.27 | 151.13,16.51 151.13,30.73 arc90 150.11,31.75 135.13,31.75 | 93.98,38.61 arc59 91.69,40.39 arc-6 89.15,40.89 | 67.46,39.93 65.51,40.01 arc-41 63.84,40.04 arc31 57.6,40.48 54.91,40.38 arc-90 55.02,40.32 arc9 57.48,38.15 arc-45 JP28.1 | U3.H1 43.2,39.55 arc55 U3.V1
  Top 0.61: 42.67,48.77 JP9.3 | 135.13,31.75 arc-99 133.35,33.53 133.35,47.75 arc103 132.33,48.77 131.57,48.77 | 94.61,33.55 94.61,35.43 arc23 93.98,38.61 | 28.96,1.27 28.96,14.99 28.96,16 arc-27 31.24,25.65 arc-79 33.02,26.67 50.8,26.67 arc90 52.58,27.94 52.58,37.59 arc-90 54.91,40.38
  Top 0.813: 23.11,1.27 11.43,1.27 4.06,1.27 arc-95 1.27,4.32 1.27,16.51 1.27,28.7 arc-96 3.81,31.59 18.03,31.59 arc90 19.3,33.01 19.3,41.15 19.3,47.24 arc-90 20.07,48.77 24.89,48.77 33.78,48.77 42.67,48.77 51.56,48.77 60.45,48.77 69.34,48.77 78.23,48.77 87.12,48.77 96.01,48.77 104.9,48.77 113.79,48.77 122.68,48.77 131.57,48.77 | 25.15,1.27 27.69,1.27 | 27.69,1.27 28.96,1.27 38,1.27 40.33,1.27 42.54,1.27 64.39,1.25 70.36,1.25 74.4,1.27 78.23,1.27 129.05,1.27 arc39 128.27,5.08 arc-30 125.48,10.67 arc59 118.11,19.05 arc-1 113.79,20.57 arc-65 112.01,22.86 arc69 106.43,29.46 arc-14 JP1.4 94.74,33.53 94.56,33.43 94.61,33.55 | 27.69,1.27 27.69,2.64
  Bottom 0.178: C3.1 v71.45,42.92 | JP12.3 69.85,45.72
  Bottom 0.2: v71.45,42.92 JP12.3 | U1.H1 JP17.3 | v87.65,38.35 84.58,35.94 83.01,34.35 arc74 v82.95,33.91 | v70.36,2.79 70.36,8.89 v70.48,10.59 | v37.08,14.99 v45.72,13.46 | v45.72,11.68 arc8 v48.51,4.57 | v94,23.44 arc45 v82.19,27.23
  Bottom 0.61: U3.H1 JP9.3
BATTIN  (2 unrouted)
GND  (via drill 0.6)  (30 unrouted)
  Top 0.178: C6.1 83.72,23.85 v84.98,23.11
  Top 0.2: C7.2 v63.87,22.05 63.57,23.59 | U$1.31 v74.55,39.4 | U$1.15 79.72,38.44 v79.13,38.01 | U$1.45 70.25,35.74 | U$1.75 75.39,26.19 arc59 v76.05,26.56 | v84.98,23.12 C9.2 | v89.25,39.75 90.78,38.75 | v93.34,30.28 C11.1 | C1.1 90.78,38.75 | 27.69,4.45 v27.69,5.59 | U$1.65 72.59,29.03 arc6 v73.96,29.61 | v70.93,35.45 70.25,35.74 | v69.34,16.76 68.33,18.03 arc35 65.28,20.07 62.48,22.1 C5.2
  Top 0.203: U$1.36 72.85,38.25 73.18,38.12
  Top 0.254: 87.78,39.88 v89.25,39.75
  Top 0.406: v64.1,40.98 C4.1 | v64.41,38.76 65.63,38.86
  Bottom 0.2: 68.72,29.04 68.85,28.92 arc79 70.67,28.81 71.74,29.89 | U$4.14 62.01,12.81 arc-30 U$4.11
  other vias: 73.2,38.1
  pour Bottom: -12.7,54.61 156.21,54.61 156.21,-12.7 -12.7,-12.7
INT  (2 unrouted)
  Top 0.2: U$1.52 67.82,31.62 arc-60 66.93,31.65 arc13 58.75,33.62 arc-62 56.68,35.07 arc68 54.89,35.26
J1S  (via drill 0.6)  (3 unrouted)
  Top 0.2: U4.B1A 13.46,25.91 arc12 17.53,25.15 arc72 20.83,27.18 arc-54 22.61,28.7 arc25 35.05,34.8 arc-39 v40.89,36.83 | U$1.49 67.82,35.94 arc25 66.19,37.03 arc-2 63.75,38.05 arc-50 63.22,38.66 arc2 v62.97,39.22
  Bottom 0.2: v40.89,36.83 arc54 46.83,38.59 | 52.28,41.38 arc-11 54.3,41.35 60.62,41.32 arc-84 62.76,39.81 arc13 v62.97,39.22 | 46.82,38.59 47.17,38.86 arc-23 52.28,41.38
J1X  (via drill 0.6)  (3 unrouted)
  Top 0.2: v71.49,31.9 71.49,32.55 arc-12 71.93,35.14 arc83 70.71,36.47 U$1.43 | U4.H2 14.73,4.83 arc-38 v27.18,13.21 | v31.75,18.8 34.54,22.35 arc-7 36.58,24.64 arc-48 39.88,25.91 55.62,25.88 arc16 v60.47,28.84
  Bottom 0.2: v27.18,13.21 v31.75,18.8 | v60.47,28.84 60.35,29.76 | 68.46,33.18 arc53 v71.49,31.9 | 68.46,33.18 67.93,33.66 arc81 63.51,33.59 arc7 61.95,32.16 arc-44 61.06,31.76 arc100 60.22,30.68 60.36,29.76
J1Y  (via drill 0.6)  (5 unrouted)
  Top 0.2: v68.61,39.42 arc-36 68.68,38.33 arc67 68.9,37.7 69.8,36.8 | U4.V2 5.08,15.24 arc99 4.83,18.54 arc-89 4.32,21.59 arc-1 8.13,26.92 arc-60 12.19,28.7 arc47 35.31,35.81 arc-34 v42.11,37.78
  Bottom 0.2: v42.11,37.78 arc27 45.92,38.64 | 52.22,41.82 62.16,41.79 | v68.61,39.42 arc52 67.6,39.94 | 67.6,39.94 66.07,40.08 arc-83 65.01,41.13 arc91 64.21,41.87 arc-1 62.16,41.79 | 52.22,41.82 52.07,41.81 arc22 45.92,38.64
J2S  (via drill 0.6)  (2 unrouted)
  Top 0.2: U$1.50 67.54,35.66 arc20 66.62,36.22 arc-3 62.74,37.85 arc-42 61.98,38.61 arc39 61.09,39.55 v59.15,39.63
  Bottom 0.2: v59.15,39.63 59.18,39.99 arc90 58.05,40.86 53.71,40.86 arc90 52.34,39.55 52.32,28.45 arc-97 49.28,25.65 arc12 44.2,25.65 arc64 41.91,23.88 arc55 42.42,19.81 U3.B1A
J2X  (via drill 0.6)  (7 unrouted)
  Top 0.2: v72.77,35.46 U$1.41
  Bottom 0.2: 40.56,40.77 41.83,39.85 | 52.18,42.74 64.1,42.79 | 69.27,40.69 70.88,39.71 72.07,38.58 arc87 72.41,38.58 72.68,38.85 arc-95 73.75,38.8 73.91,38.65 arc-93 73.92,37.36 arc30 v72.77,35.46 | 64.1,42.79 64.47,42.72 arc-25 69.27,40.68 | 52.18,42.75 45.41,40.78 arc37 44.14,39.9 arc-104 41.84,39.85
J2Y  (via drill 0.6)  (6 unrouted)
  Top 0.2: v69.93,39.19 arc-67 69.8,38.71 arc80 69.82,37.88 arc-3 U$1.42 | U3.V2 48.03,33.3 arc-24 45.72,36.83 arc-50 v45.32,39.4
  Bottom 0.2: 52.16,42.28 64.18,42.33 arc-64 65.63,41.24 | v69.93,39.19 arc46 68.85,40.32 | 68.85,40.32 68.43,40.35 66.45,40.49 arc-71 65.64,41.23 | 52.16,42.28 50.64,41.8 arc14 v45.32,39.4
J3S  (via drill 0.6)  (4 unrouted)
  Top 0.2: U1.B1A 110.57,16.41 arc-53 101.22,19.86 arc12 95.96,24.05 arc-10 92.94,24.94 arc-62 89.51,30.79 arc44 v88.75,32.74 | v78.86,35.51 80.13,36.71 | 80.97,37.41 U$1.11 | 80.13,36.71 80.98,37.42
  Bottom 0.2: v78.86,35.51 arc57 79.3,34.16 arc33 82.35,32.59 arc34 84.07,32.77 arc-11 84.84,33.27 arc-80 v88.75,32.74
J3X  (via drill 0.6)  (2 unrouted)
  Top 0.2: v81,35.8 U$1.8 | U1.H2 111.5,41.3 arc75 107.8,43.1 arc3 106.5,42.8 arc-19 102.9,42.5 arc16 97.3,42.2 arc113 v95.5,37.8
  Bottom 0.2: v95.5,37.8 95.3,38.1 arc39 91.8,40.7 arc3 89.3,41.39 arc22 87.78,41.47 80.98,40.55 arc35 80.19,40.18 arc4 79.02,39.04 arc-43 78.67,38.88 arc100 78.01,38.17 arc37 78.89,36.77 arc23 v81,35.8
J3Y  (via drill 0.6)  (2 unrouted)
  Top 0.2: v102.2,33.6 arc-61 103.7,34.2 arc-6 122,30.4 arc-32 U1.V2 | U$1.9 82.62,37.94 arc-2 83.3,38.6 arc-79 84.9,38.7 arc-8 86.8,37.1 arc35 88.4,36.3 arc-85 91.4,32.5 arc29 92.35,28.41 arc63 93.55,27.44 arc4 97.19,26.58 arc86 v100.6,29.2
  Bottom 0.2: v100.6,29.2 arc-36 v102.2,33.6
J4S  (via drill 0.6)  (2 unrouted)
  Top 0.2: 134.9,26.67 131.06,25.4 arc3 v125.48,23.37 | v110.62,20.04 arc-49 96.67,24.46 arc-17 91.67,26.57 arc-19 90.17,29.74 arc-13 89.92,32.79 arc62 v88.62,34.27 | U$1.10 81.31,37.19 80.62,36.59 arc54 80.01,35.56 v80.01,34.8
  Bottom 0.2: v110.62,20.04 arc14 v125.48,23.37 | v88.62,34.27 arc56 84.07,33.5 arc-86 81.79,33.41 arc15 v80.01,34.8
J4X  (via drill 0.6)  (2 unrouted)
  Top 0.2: v140.21,14.22 U2.H2 | v139.45,19.81 arc-33 138.43,25.15 arc140 131.57,28.45 arc-86 118.36,28.19 arc30 109.98,32.51 arc15 v104.39,33.02 | v99.06,24.89 93.7,26.24 arc-61 91.21,28.37 arc-27 90.37,33.05 arc75 87.88,35.51 arc-26 85.62,36.73 arc2 84.76,37.52 arc93 83.87,37.44 83.44,37.06 82.91,36.52
  Bottom 0.2: v139.45,19.81 arc-39 v140.21,14.22 | v104.39,33.02 103.89,32 arc10 101.6,27.18 arc-55 v99.06,24.89
J4Y  (via drill 0.6)  (2 unrouted)
  Top 0.2: U$1.7 83.17,37.36 arc1 84,38.2 arc-104 84.9,38.1 86.1,37.1 arc10 87.4,36.2 arc26 88.4,35.9 88.7,35.8 arc-74 90.9,32.6 arc22 91.85,28.13 arc36 93.38,26.96 arc32 99.72,26.36 v103.63,25.91
  Top 0.203: v115.06,25.91 118.87,25.91 arc-81 124.21,21.34 arc13 125.73,15.75 arc58 127.89,13.97
  Bottom 0.2: v103.63,25.91 v115.06,25.91
LCDD1  (2 unrouted)
  Top 0.2: 73.18,27.36 72.62,26.8 arc66 72.24,25.02 arc39 U$4.27
LCDD2  (2 unrouted)
  Top 0.2: U$1.68 72.31,27.08 arc66 71.91,24.71 arc24 U$4.25
LCDD3  (2 unrouted)
  Top 0.2: U$1.67 72.03,27.36 arc72 71.6,24.26 arc-15 72.92,20.65 arc28 U$4.23
LCDD4  (2 unrouted)
  Top 0.2: U$1.66 71.78,27.66 arc77 71.35,23.77 arc-36 71.5,20.98 arc29 U$4.21
LCDE  (2 unrouted)
  Top 0.2: U$1.70 72.9,26.52 arc77 72.72,24.97 arc27 81.53,16.26 arc-24 U$4.29
LCDR/W  (2 unrouted)
  Top 0.2: 73.74,26.8 73.18,26.24 arc85 73.13,25.12 arc24 84.12,16.43 arc-32 U$4.31
LCDRS  (2 unrouted)
  Top 0.2: U$1.72 73.48,25.96 arc90 73.48,25.4 arc21 86.46,16.41 arc-38 U$4.33
MCLR  (2 unrouted)
  Top 0.2: 80.95,38.53 81.48,39.06 arc-79 84.39,39.57 arc-5 86.86,37.71 arc41 88.83,36.65 arc-4 90.92,36.44 arc-96 92.46,34.8 92.51,33.5
N$1  (via drill 0.6)  (2 unrouted)
  Top 0.2: U$1.78 78.66,25.65 arc-73 78.74,25.15 arc-6 v77.22,23.57 | v73.08,17.37 74.17,16 arc-37 74.55,14.86 74.57,11.4 arc43 76.2,7.37 arc7 79.22,4.55
  Bottom 0.2: v73.08,17.37 73.61,18.95 v77.22,23.57
N$2  (1 unrouted)
N$3  (1 unrouted)
N$4  (2 unrouted)
  Top 0.2: R2.1 R3.1 JP1.5
N$5  (via drill 0.6)  (2 unrouted)
  Top 0.2: 78.69,26.77 79.22,26.24 arc-88 79.25,24.64 arc33 v78.61,23.7 | v75.95,9.45 79.22,7.09
  Bottom 0.2: v78.61,23.7 74.24,18.62 arc50 74.17,17.27 arc-1 74.57,15.11 74.6,11.15 arc94 v75.95,9.45
N$6  (via drill 0.6)  (2 unrouted)
  Top 0.2: U$1.81 79.5,26.52 arc-63 80.01,24.38 arc-22 v78.56,22.2 | v78.05,9.5 arc50 79.53,8.33 arc-92 80.54,7.57 80.52,5.59 arc88 81.76,4.29
  Bottom 0.2: v78.56,22.2 arc-4 76.91,20.42 arc50 76.91,18.34 arc-1 77.09,15.14 77.09,11.33 arc50 v78.05,9.5
N$7  (via drill 0.6)  (4 unrouted)
  Top 0.2: U$1.17 79.23,39.08 arc-35 78.75,38.83 arc78 78.28,38.29 arc-4 78.23,37.79 78.23,37.51 arc-92 77.65,36.95 arc94 76,35.3 arc-79 v72.8,31.1 | v58.49,21.32 59.2,15.3 arc13 59.31,14.67 59.31,14.06 arc68 U$4.12 arc-29 62.11,11.04 arc58 R7.2
  Bottom 0.2: v72.8,31.1 arc-64 68.1,32.7 arc97 63.5,32.9 arc36 61.3,28.4 arc-33 60.8,27.3 arc60 60.4,25.2 61.31,21.74 arc6 61.32,21.74 arc-116 60.22,20.57 arc2 58.47,21.32
N$9  (via drill 0.6)  (2 unrouted)
  Top 0.2: 79.25,27.33 79.78,26.8 80.24,26.24 80.34,26.04 arc-57 80.26,23.7 arc54 v80.14,21.06 | v80.26,9.65 arc-38 81.76,6.83
  Bottom 0.2: v80.14,21.06 arc32 79.45,19.76 arc1 79.58,15.27 arc-1 79.65,11.02 arc46 v80.26,9.65
N$10  (via drill 0.6)  (4 unrouted)
  Top 0.2: U$1.29 74.55,40.51 arc16 75.03,40.13 arc-75 75.41,39.19 arc45 v75.82,38.23 | 59.61,20.59 60.84,18.82 arc-10 61.76,15.91 61.9,14.79 61.87,14.36 arc62 62.42,13.29 arc36 62.79,13.2 63.49,13.21 arc-52 U$4.16 | v59.42,22.48 59.62,20.6
  Bottom 0.2: v75.82,38.23 arc-10 76.33,36.37 arc-49 76.17,34.8 arc0 75.31,33.33 arc-97 73.13,32.89 arc42 71.81,33.27 arc-20 69.55,33.48 arc-39 69.22,33.71 arc78 64.11,35.1 arc20 62.18,33.83 arc-25 60.27,32.72 arc60 59.31,31.65 arc11 59,29.03 arc11 59.41,23.16 arc-59 v59.42,22.48
N$11  (via drill 0.6)  (2 unrouted)
  Top 0.2: U$1.83 80.06,27.1 arc-59 80.9,24.11 arc61 v82.04,20.32 | v82.35,9.58 arc-23 83.03,7.01 83.03,6.27 arc73 84.3,4.55
  Bottom 0.2: v82.04,20.32 82.19,14.94 82.17,11.3 arc23 v82.35,9.58
N$12  (via drill 0.6)  (2 unrouted)
  Top 0.2: U$1.84 80.34,27.38 arc-41 81.41,25.02 arc45 82.93,21.89 arc-14 v84.33,20.32 | 84.3,7.09 arc35 v84.84,9.65
  Bottom 0.2: v84.33,20.32 84.68,15.27 84.73,11.38 arc5 v84.84,9.65
N$13  (via drill 0.6)  (6 unrouted)
  Top 0.2: U$4.13 arc17 v60.42,21.55 | U$1.28 74.85,40.79 arc11 75.41,40.34 arc-68 v77.2,37.78
  Bottom 0.2: v77.2,37.78 arc-39 76.43,34.34 arc8 75.54,32.87 arc-106 72.97,32.43 arc54 71.57,32.78 arc-40 69.04,33.26 | 68.48,33.85 arc18 66.67,34.85 arc33 65.43,34.96 arc34 62.05,33.17 arc-36 60.66,32.31 arc75 59.65,31.34 | 68.49,33.85 69.03,33.26 | 59.64,31.34 59.61,31.11 arc15 59.74,25.65 arc7 60.38,22.76 arc-41 v60.43,21.54
N$14  (via drill 0.6)  (7 unrouted)
  Top 0.2: v58.47,23.44 arc-37 59.89,23.39 | 71.48,38.48 72.64,37.39 arc27 73.05,37.13 arc28 73.48,37.11 arc-17 v75.09,37.18 | 63.47,18.65 arc29 65.48,16.97 U$4.15 | 59.89,23.39 60.73,22.84 arc-28 63.48,18.64
  Bottom 0.2: v75.09,37.18 75.44,36.83 arc-86 75.69,35.05 arc7 74.93,33.78 arc-35 74.45,33.12 arc-77 73.15,33.53 arc47 72.62,33.73 arc6 71.09,33.68 arc-32 69.62,33.93 69.32,34.29 arc89 62.43,34.62 arc-15 60.81,33.45 arc-32 60.17,33.2 arc49 59.66,33.02 arc43 58.73,30.86 | v58.47,23.44 arc-5 58.62,25.71 arc-7 58.65,30.02 58.73,30.86
N$15  (via drill 0.6)  (2 unrouted)
  Top 0.2: 81.23,29.31 81.79,28.75 arc26 83.77,27.51 arc-31 84.51,27 arc12 85.98,25.58 arc-86 86.13,24.59 arc54 85.98,23.39 arc-14 v86.61,20.57 | v87.27,9.63 arc53 85.57,7.59 85.57,5.56 arc90 86.84,4.29
  Bottom 0.2: v86.61,20.57 arc3 87.25,15.27 87.25,11.33 arc-49 v87.27,9.63
N$16  (2 unrouted)
  Top 0.2: U$1.90 82.04,29.08 arc31 84.07,27.91 arc-40 84.84,27.43 86.36,25.91 arc-71 86.61,24.38 arc52 86.61,23.37 arc-4 87.63,21.08 arc-4 89.74,15.44 89.79,11.2 arc-67 88.7,9.47 arc62 86.84,6.83
N$17  (via drill 0.6)  (2 unrouted)
  Top 0.2: U$1.91 82.32,29.36 arc31 84.2,28.3 arc-30 85.17,27.76 86.82,26.14 arc-68 87.17,24.38 arc66 87.38,23.29 v88.9,20.75 | v90.25,9.42 89.23,8.69 arc17 88.11,7.59 88.11,5.05 arc96 88.65,4.57 89.38,4.55
  Bottom 0.2: v88.9,20.75 89.74,15.39 89.81,10.92 arc-19 v90.25,9.42
N$18  (2 unrouted)
  Top 0.2: U$1.92 82.63,29.62 arc34 84.33,28.7 arc-39 85.6,27.94 87.12,26.42 arc-62 87.63,24.38 arc62 87.88,23.37 arc-7 89.92,21.08 arc-46 90.07,20.52 92.33,15.24 92.35,12.12 arc-48 90.91,8.81 89.38,7.09
N$19  (via drill 0.6)  (2 unrouted)
  Top 0.2: U$1.93 82.91,29.9 arc39 84.33,29.21 arc-47 86.11,28.19 87.63,26.67 arc-62 88.14,24.64 arc62 88.39,23.62 v91.19,20.83 | v92.96,9.45 90.96,7.8 arc50 90.68,7.21 arc1 90.68,5.51 arc90 91.92,4.29
  Bottom 0.2: v91.19,20.83 92.35,15.24 92.35,11.3 arc55 v92.96,9.45
N$20  (2 unrouted)
  Top 0.2: 82.65,30.73 83.19,30.2 arc39 84.18,29.67 arc-46 86.44,28.47 87.94,26.92 arc-58 88.57,24.59 arc64 88.85,23.75 arc4 91.9,21.41 arc-22 97.84,15.19 97.87,11.43 arc-80 96.9,10.26 arc38 93.27,8.46 arc-10 91.92,6.83
N$21  (2 unrouted)
  Top 0.2: 83.21,31.29 83.74,30.76 arc26 85.34,29.77 arc-26 86.33,29.16 88.14,27.33 arc-53 89.03,24.59 arc67 89.33,23.93 94.34,20.07 arc-24 98.4,15.24 98.42,11.28 arc-85 96.95,9.65 arc43 93.47,7.9 arc48 93.19,7.04 arc42 94.46,4.55
N$23  (2 unrouted)
  Top 0.2: 83.46,31.6 84.02,31.04 arc24 85.37,30.25 arc-27 86.94,29.18 88.57,27.43 arc-52 89.48,24.69 arc64 89.71,24.18 arc-6 94.87,20.3 arc-21 98.98,15.27 98.96,11.12 arc-80 97.18,9.04 arc53 94.46,7.09
N$24  (2 unrouted)
  Top 0.2: U$1.98 84.3,31.34 arc27 85.52,30.61 arc-34 87.53,29.16 89.2,27.33 arc-51 89.92,24.69 arc77 90.04,24.46 94.74,21.08 arc-27 99.57,15.49 99.57,11.18 arc-81 97.31,8.51 arc45 95.83,7.59 95.76,7.19 95.73,5.54 arc93 97,4.29
N$25  (2 unrouted)
  Top 0.2: U$1.99 84.58,31.62 arc30 85.88,30.94 arc-39 87.73,29.59 89.53,27.58 arc-47 90.45,24.87 arc71 90.6,24.61 96.01,20.83 arc-33 100.13,15.75 100.13,11.18 arc-63 98.04,7.87 arc36 97,6.83
N$39  (via drill 0.6)  (5 unrouted)
  Top 0.2: U$1.1 83.78,34.57 arc81 83.76,34.29 arc-45 83.88,33.92 arc-17 83.71,33.35 arc-32 83.46,33.16 arc-60 82.33,33.11 arc79 81.18,32.87 arc92 v80.82,31.33 | v50.75,18.42 R6.1 U$4.3
  Bottom 0.2: v80.82,31.33 80.28,30.36 arc-31 77.33,27.79 76.52,27.55 arc13 73.87,26.7 arc-22 73.62,26.72 arc127 72.87,24.88 arc-32 73.4,23.5 arc-29 73,20.1 arc-99 67.6,18.2 arc86 62.39,18.05 | v50.75,18.42 arc64 55.51,16.88 | 55.52,16.89 62.41,18.06
N$40  (via drill 0.6)  (4 unrouted)
  Top 0.2: U$1.3 83.22,35.14 arc-40 82.53,34.82 arc50 82.32,34.7 80.54,32.86 arc32 v79.47,30.72 | v52.41,18.51 52.21,17.2 arc17 51.7,15.09 51.7,13.42 arc-53 51.51,13.04 arc2 U$4.4
  Bottom 0.2: v79.47,30.72 arc-26 78.9,29.6 arc-15 77.8,28.5 arc-27 76.9,28.1 arc10 74.4,27.4 arc-9 73,27 arc112 72.2,25.1 arc-50 72.8,20.9 arc-103 67.5,18.8 arc26 65.74,19.53 | 65.73,19.53 65.46,19.56 arc44 62.38,18.64 61.65,18.31 56.49,17.48 arc-47 v52.43,18.52
N$41  (via drill 0.6)  (5 unrouted)
  Top 0.2: U$1.12 80.67,37.69 arc-13 80.27,37.39 79.31,36.49 arc-53 78.92,36.36 arc71 77.94,35.89 arc16 v77.1,31.5 | U$4.6 arc-4 54.09,13.14 arc46 54.22,13.45 54.22,15.49 arc34 54.12,16.48 arc-42 53.38,18.94 arc-14 53.44,19.55 arc-86 54.6,20.23 arc-38 v55.53,20.11
  Bottom 0.2: v77.1,31.5 74.86,28.98 arc-10 72.27,28.23 arc115 71.07,24.25 arc-59 71.6,21.6 arc-96 68,20 arc71 61.82,20.12 arc-41 60.71,19.57 arc6 58.95,19.48 | v55.52,20.12 arc-65 56.67,19.87 | 58.95,19.48 58.24,19.53 arc-16 56.67,19.86
N$42  (via drill 0.6)  (4 unrouted)
  Top 0.2: U$1.4 82.92,35.41 arc-62 82.36,35.24 arc68 82.08,35.09 80.18,33.12 arc18 78.45,30.69 arc-25 v77.29,29.25 | v54.33,19.29 54.3,18.99 arc62 54.93,16.97 arc-52 55.4,16.1 arc4 U$4.7
  Bottom 0.2: v77.29,29.25 arc-22 75.45,28.22 arc-7 73.22,27.52 arc-3 72.67,27.37 arc120 71.74,24.93 arc-79 71.7,19.9 arc-83 67.52,19.31 | v54.33,19.29 arc75 56.79,18.08 | 56.79,18.09 58.55,18.36 arc-3 61.34,18.75 arc41 62.59,19.38 arc-36 63.65,19.99 arc-44 67.54,19.3
N$43  (via drill 0.6)  (2 unrouted)
  Top 0.2: U$1.14 80.1,38.25 arc67 80.04,38.02 arc-72 79.9,37.6 79.51,37.21 arc-54 78.74,36.93 arc41 78.27,36.77 arc47 76.3,33.89 arc-47 v74.59,30.9 | U$4.9 v57.08,20.81
  Bottom 0.2: v74.59,30.9 arc-5 73.24,30.33 arc-44 72.28,30.24 arc5 70.32,30.73 arc-45 67.97,32.1 arc113 63.54,32.32 arc21 61.52,27.64 arc-31 61.17,26.99 arc60 60.78,25.42 arc-1 61.79,21.68 arc-94 61.07,20.22 arc-4 60.78,20.1 arc-18 58.77,20.13 arc-53 v57.08,20.81
N$44  (via drill 0.6)  (5 unrouted)
  Top 0.2: U$1.5 82.67,35.73 arc-78 82.28,35.69 arc104 81.96,35.58 80.3,33.9 arc-31 v78.39,32.59 | v56.28,18.94 56.81,15.89 56.8,13.5 arc76 U$4.10
  Bottom 0.2: v78.39,32.59 arc90 77.9,31.9 arc-28 77.9,31 77.4,30.5 75.21,28.69 arc-22 72.74,27.87 arc124 71.45,24.49 arc-14 71.73,24.11 arc-51 71.83,20.89 arc-43 70.8,19.72 arc-10 69.6,19.32 arc-46 67.48,19.83 | 67.48,19.83 arc-7 66.83,20.13 arc50 62.81,20.14 arc2 62.22,19.72 arc-41 60.9,19.13 | v56.28,18.94 arc37 58.11,18.85 | 58.12,18.85 60.91,19.13
N$50  (via drill 0.6)  (4 unrouted)
  Top 0.2: 71.17,38.23 71.73,37.69 arc5 72.75,36.8 arc43 73.08,36.7 arc-37 74.91,36.25 arc-70 75.36,35.13 arc-75 74.65,34.54 arc81 v74.04,33.98 | v57.1,22.15 56.11,21.34 arc-23 54.84,20.98 arc26 53.31,20.34 arc-51 52.22,20.14 arc48 51.31,19.99 47.52,18.09 arc31 46.35,17.02 arc0 45.82,16.15 arc-50 43.61,14.68 arc96 43.33,14.25 44.02,10.67 arc91 44.4,10.41 62.15,10.03 arc-33 63.27,9.68 arc34 64.34,9.35 arc-42 65.71,8.81 arc41 66.47,8.51 arc3 67.13,8.51 arc-22 67.87,8.38 arc25 68.76,8.36 arc-7 69.55,8.36 arc1 71.88,8.1 arc-79 72.82,7.24 arc-10 72.87,6.22 arc54 73.23,5.46 arc-14 74.14,4.55 arc16 75.06,3.66 arc-18 75.72,3 arc31 76.43,2.44
  Bottom 0.2: v74.04,33.98 72.64,34.14 arc14 70.61,34.11 arc-64 69.6,34.57 arc78 63.98,36.3 61.06,34.09 arc-30 60.38,33.81 arc73 58.42,31.93 arc13 58.14,29.67 arc-6 57.84,24.77 arc-22 57.66,24.21 arc28 57.48,23.52 arc-30 v57.1,22.15
N$51  (via drill 0.6)  (7 unrouted)
  Top 0.2: U$1.40 71.5,37.36 arc8 72.57,36.42 arc44 72.87,36.3 arc-68 v74.5,35.41 | v55.65,22.2 54.63,21.44 53.03,20.78 arc-40 52.2,20.65 arc40 51.21,20.5 47.12,18.34 arc36 45.64,16.82 arc-38 44.48,15.65 arc-15 43.18,15.21 arc99 42.72,14.4 43.59,10.11 arc82 43.92,9.86 61.98,9.5 arc-35 63.17,9.09 arc41 64.16,8.81 arc-54 65.53,8.26 arc49 65.91,8.08 arc1 67.06,8.08 arc-82 67.72,7.52 arc-1 67.87,6.48 arc69 68.43,5.87 arc21 69.62,5.82 arc-67 70.74,5.28 arc20 71.6,4.29 arc-51 71.93,3.61 arc58 R10.1
  Bottom 0.2: v74.5,35.41 73.66,34.95 arc-51 72.62,34.59 arc17 70.71,34.54 arc-67 69.9,34.9 arc104 62.23,35.56 60.45,34.29 59.44,34.04 arc39 58.49,33.29 arc20 58.01,32.09 | 58.01,32.09 57.88,31.57 arc14 57.66,29.81 arc-13 57.07,24.17 | 57.07,24.17 56.96,23.85 arc-34 55.64,22.2
N$52  (via drill 0.6)  (5 unrouted)
  Top 0.2: U$1.47 69.46,35.43 arc-88 69.57,34.44 arc-3 69.14,34.01 arc-95 67.84,34.09 arc49 66.42,34.87 arc-9 62,35.43 arc41 v60.17,35.2 | v54.2,22.23 52.86,21.36 arc-42 52.25,21.23 arc37 51.31,21.08 46.84,18.75 arc32 45.16,17.14 arc-55 42.85,15.7 arc101 42.09,14.61 43.13,9.55 arc96 43.56,9.3 62.1,8.97 arc-40 62.97,8.64 arc41 63.65,8.38 arc0 64.26,8.38 arc-96 65.28,7.21 arc28 65.43,6.1 arc62 66.09,5.61 arc5 66.8,5.56 arc-45 69.06,4.55
  Bottom 0.2: v60.17,35.2 58.99,34.61 | 59,34.61 58.42,34.1 arc34 57.24,30.97 arc-1 56.93,26.95 arc-16 56.24,23.96 v54.21,22.23
N$58  (via drill 0.6)  (3 unrouted)
  Top 0.2: U$1.48 69.19,35.13 arc-90 69.22,34.75 68.78,34.31 arc-96 68.2,34.37 arc48 66.42,35.31 arc-17 60.91,36.35 arc72 v58.93,35.87 | v52.55,22.2 47.07,19.36 arc27 44.7,17.3 arc-52 42.75,16.23 arc99 41.5,14.63 42.67,9.09 arc87 43.26,8.69 61.9,8.46 arc-87 62.61,7.77 arc11 62.79,6.53 arc74 63.63,5.84 arc1 64.44,5.82 arc-53 65.66,5.18 arc16 66.52,4.29
  Bottom 0.2: v58.93,35.87 58.06,34.59 arc38 56.64,30.23 arc-7 56.39,26.42 arc-31 54.73,23.86 v52.56,22.21
N$59  (via drill 0.6)  (3 unrouted)
  Top 0.2: U$1.56 68.93,30.47 arc-60 66.26,29.79 arc61 61.35,28.43 arc-32 55.8,25.4 44,25.4 arc90 39,20.4 arc22 v39.7,7.4 R11.2
  Bottom 0.2: v39.7,7.4 arc70 48.8,2 52.1,2 arc86 53.7,3.5 arc-5 U$12.37
N$60  (3 unrouted)
  Top 0.2: U$1.57 69.22,30.2 arc-59 66.28,29.24 arc61 61.88,28.16 arc-30 56.16,24.93 arc-18 55.02,24.83 arc36 48.9,22.5 arc-20 43,20.9 arc89 39.39,14.97 40.2,9.5 arc22 40.97,7.29 | 40.97,7.29 arc71 44.12,5.57 arc1 52.18,5.55 arc21 53.2,5.71 arc-65 55.06,5.35 arc3 U$12.35 | R12.2 40.97,7.29
N$61  (via drill 0.6)  (3 unrouted)
  Top 0.2: U$12.33 arc-7 58.9,2.9 arc-77 58.1,2 47.5,2 arc-85 v44.56,4.49 R13.2 | U$1.58 69.39,29.8 arc-48 66.41,28.65 arc-10 65.85,28.85 arc61 62.28,27.85 arc-46 54.81,24.25 arc33 49.59,22.24 arc-26 45.66,20.72 arc-3 43.48,20.36 arc93 39.92,15.41 arc1 41.4,8.27 arc106 v43.77,6.54
  Bottom 0.2: v44.56,4.49 v43.77,6.54
N$62  (via drill 0.6)  (3 unrouted)
  Top 0.2: U$1.59 69.78,29.62 arc-41 66.69,28.19 arc-27 65.69,28.37 arc56 63.51,28.15 arc15 61.77,26.61 60.33,25.44 58.5,24.55 57.21,24.12 55.77,23.77 55.02,23.71 54.07,23.64 arc36 50,21.7 48.7,21 arc-25 45.2,20 arc12 43.4,19.7 arc90 40.7,15 42.1,8.4 arc89 43,7.8 arc-21 44,7.8 arc-48 v45.6,6.7 | v46.5,4.6 arc69 49.8,2.5 56.9,2.5 arc53 v57.7,2.9 | v60.1,2.9 U$12.31 R14.2
  Bottom 0.2: v57.7,2.9 v60.1,2.9 | v46.5,4.6 v45.6,6.7
OSC1  (5 unrouted)
  Top 0.2: C8.1 U$3.1 R5.1 | U$1.63 70.92,28.5 arc-8 69.23,27.02 arc-53 R5.1
OSC2  (5 unrouted)
  Top 0.2: R5.2 arc-5 U$3.2 C7.1 | U$1.64 71.19,28.21 arc3 R5.2
P1  (3 unrouted)
  Top 0.2: U$1.35 71.77,39.91 arc33 67.96,41.96 arc9 64.06,42.26 51.7,42.68 arc-9 33.43,43.94 | 33.44,43.94 32.52,43.97 arc5 JP6.2
P2  (2 unrouted)
  Top 0.178: 27.9,45.67 27.94,45.72
  Top 0.2: U$1.34 72.05,40.2 arc32 68.34,42.39 arc15 65.18,42.99 50.74,43.25 arc-9 35.12,44.63 arc6 30.84,44.9 arc-37 27.9,45.67 arc-8 JP7.2
P3  (2 unrouted)
  Top 0.2: U$1.33 72.34,40.47 arc42 65.83,43.4 arc3 61.03,43.61 arc-8 41.54,44.67 arc-18 37.07,45.18 arc-65 JP8.2
P4  (3 unrouted)
  Top 0.2: U$1.32 72.63,40.75 arc45 65.57,44.05 arc-5 48.17,44.59 | 48.17,44.57 47.62,44.65 arc-46 JP9.2
P5  (2 unrouted)
  Top 0.2: U$1.27 74.02,42.19 arc29 70.96,44.06 arc15 68.65,44.47 arc-2 62.87,44.58 arc1 59.72,44.71 arc1 55.1,44.8 arc-89 54.1,45.9 arc-1 JP10.2
P6  (2 unrouted)
  Top 0.178: 73.66,43.18
  Top 0.2: U$1.26 74.32,42.45 arc10 73.66,43.18 arc13 72.62,43.97 arc21 68.88,44.98 arc-1 63.95,45.05 arc-65 63.14,45.46 arc-17 JP11.2
P7  (via drill 0.6)  (3 unrouted)
  Top 0.2: U$1.25 78.1,42.5 v77.9,43.4 arc14 75.4,44.2 arc24 73.7,44.4 arc-71 JP12.2
  Bottom 0.2: v77.9,43.4 79.2,43.5 arc-20 86.2,42.8 arc4 93.4,41 arc-48 95.7,39.3 arc54 JP1.2
P8  (3 unrouted)
  Top 0.2: U$1.24 78.36,42.16 arc16 80.06,44.42 arc11 JP13.2
  Bottom 0.2: JP13.2 81.91,44.87 arc36 83.42,44.03 arc-5 JP1.1
P9  (1 unrouted)
  Top 0.178: JP14.2 88.9,45.72 88.92,45.69
  Top 0.2: U$1.23 78.64,41.88 arc-37 81.31,43.31 arc21 88.92,45.69 arc2 JP14.2
P10  (2 unrouted)
  Top 0.2: U$1.22 78.93,41.6 arc-37 80.98,42.76 arc10 87.8,44.27 arc-18 90.78,44.56 arc7 96.13,44.8 arc44 JP15.2
P11  (2 unrouted)
  Top 0.2: U$1.21 79.21,41.32 arc-36 80.96,42.22 arc5 88.68,43.85 arc-17 91.35,44.12 arc11 97.24,44.41 arc-7 101.41,44.77 arc0 104.29,44.85 arc40 JP16.2
P12  (1 unrouted)
  Top 0.178: JP17.2 115.57,45.72 115.63,45.62
  Top 0.2: U$1.20 79.5,41.04 arc-38 81.05,41.79 arc8 88.71,43.25 arc-17 91.38,43.56 arc10 97.71,43.93 arc-8 103.26,44.34 arc11 106.74,44.67 arc-11 108.52,44.84 arc3 113.33,44.96 arc27 115.63,45.62 arc9 JP17.2
P13  (2 unrouted)
  Top 0.2: U$1.19 79.79,40.77 arc-37 80.85,41.3 arc-1 84.66,41.82 arc8 88.18,42.52 arc-17 91.73,42.92 arc13 99.14,43.46 arc-12 101.67,43.66 arc11 106.85,44.04 arc-12 109.88,44.26 arc8 116.63,44.57 arc-11 119.91,44.66 arc16 123.74,44.93 arc53 JP18.2
P14  (2 unrouted)
  Top 0.2: U$1.18 80.07,40.48 arc-40 80.92,40.88 arc2 85.45,41.4 arc4 87.86,41.92 arc-16 92.01,42.38 arc10 97.92,42.72 arc-10 103.81,43.04 arc17 106.49,43.35 arc-18 109.97,43.73 arc8 114.99,43.81 arc4 116.96,44.04 arc-15 119.9,44.09 arc13 125.21,44.09 arc-19 JP19.2
PROGCAP  (2 unrouted)
  Top 0.2: C11.2 JP1.6
RESET  (2 unrouted)
  Top 0.2: U$1.51 67.64,32.03 67.28,32.16 arc13 60.18,34.16 arc-60 57.26,35.95 arc32 55.14,37.8
SCK  (3 unrouted)
  Top 0.2: U$1.55 68.53,30.64 arc-45 66.63,30.31 | 66.63,30.31 66.45,30.34 arc32 55.22,27.9 arc-10 55.12,27.64
SDI  (3 unrouted)
  Top 0.2: 68.38,31.04 68.94,31.6 | 68.38,31.04 68.1,30.86 arc-28 66.95,30.72 arc25 56.23,30.65 arc-35 JP27.2
SDO  (3 unrouted)
  Top 0.2: 68.1,31.34 U$1.53 | 68.1,31.34 67.91,31.2 arc-31 66.84,31.16 arc15 55.74,32.71 arc-48 JP27.3
VDDCORE  (2 unrouted)
  Top 0.2: U$1.85 80.7,27.58 arc-20 C6.2